# EasyEDA Pro project PCB_keyboard_V1_3_3.eprj

# Schematic PCB_keyboard
Board Name: PCB_keyboard; Create Date: 2025-07-01; Page Name: Sheet_1; Project Name: PCB_keyboard_V1_3_2; Schematic Name: PCB_keyboard; Update Date: 2025-07-01; Add into BOM: yes; Company: Your Company; Convert to PCB: yes; Date: 2025-05-16; REV: 1.0; Sheet: 1/1; spicePre: .
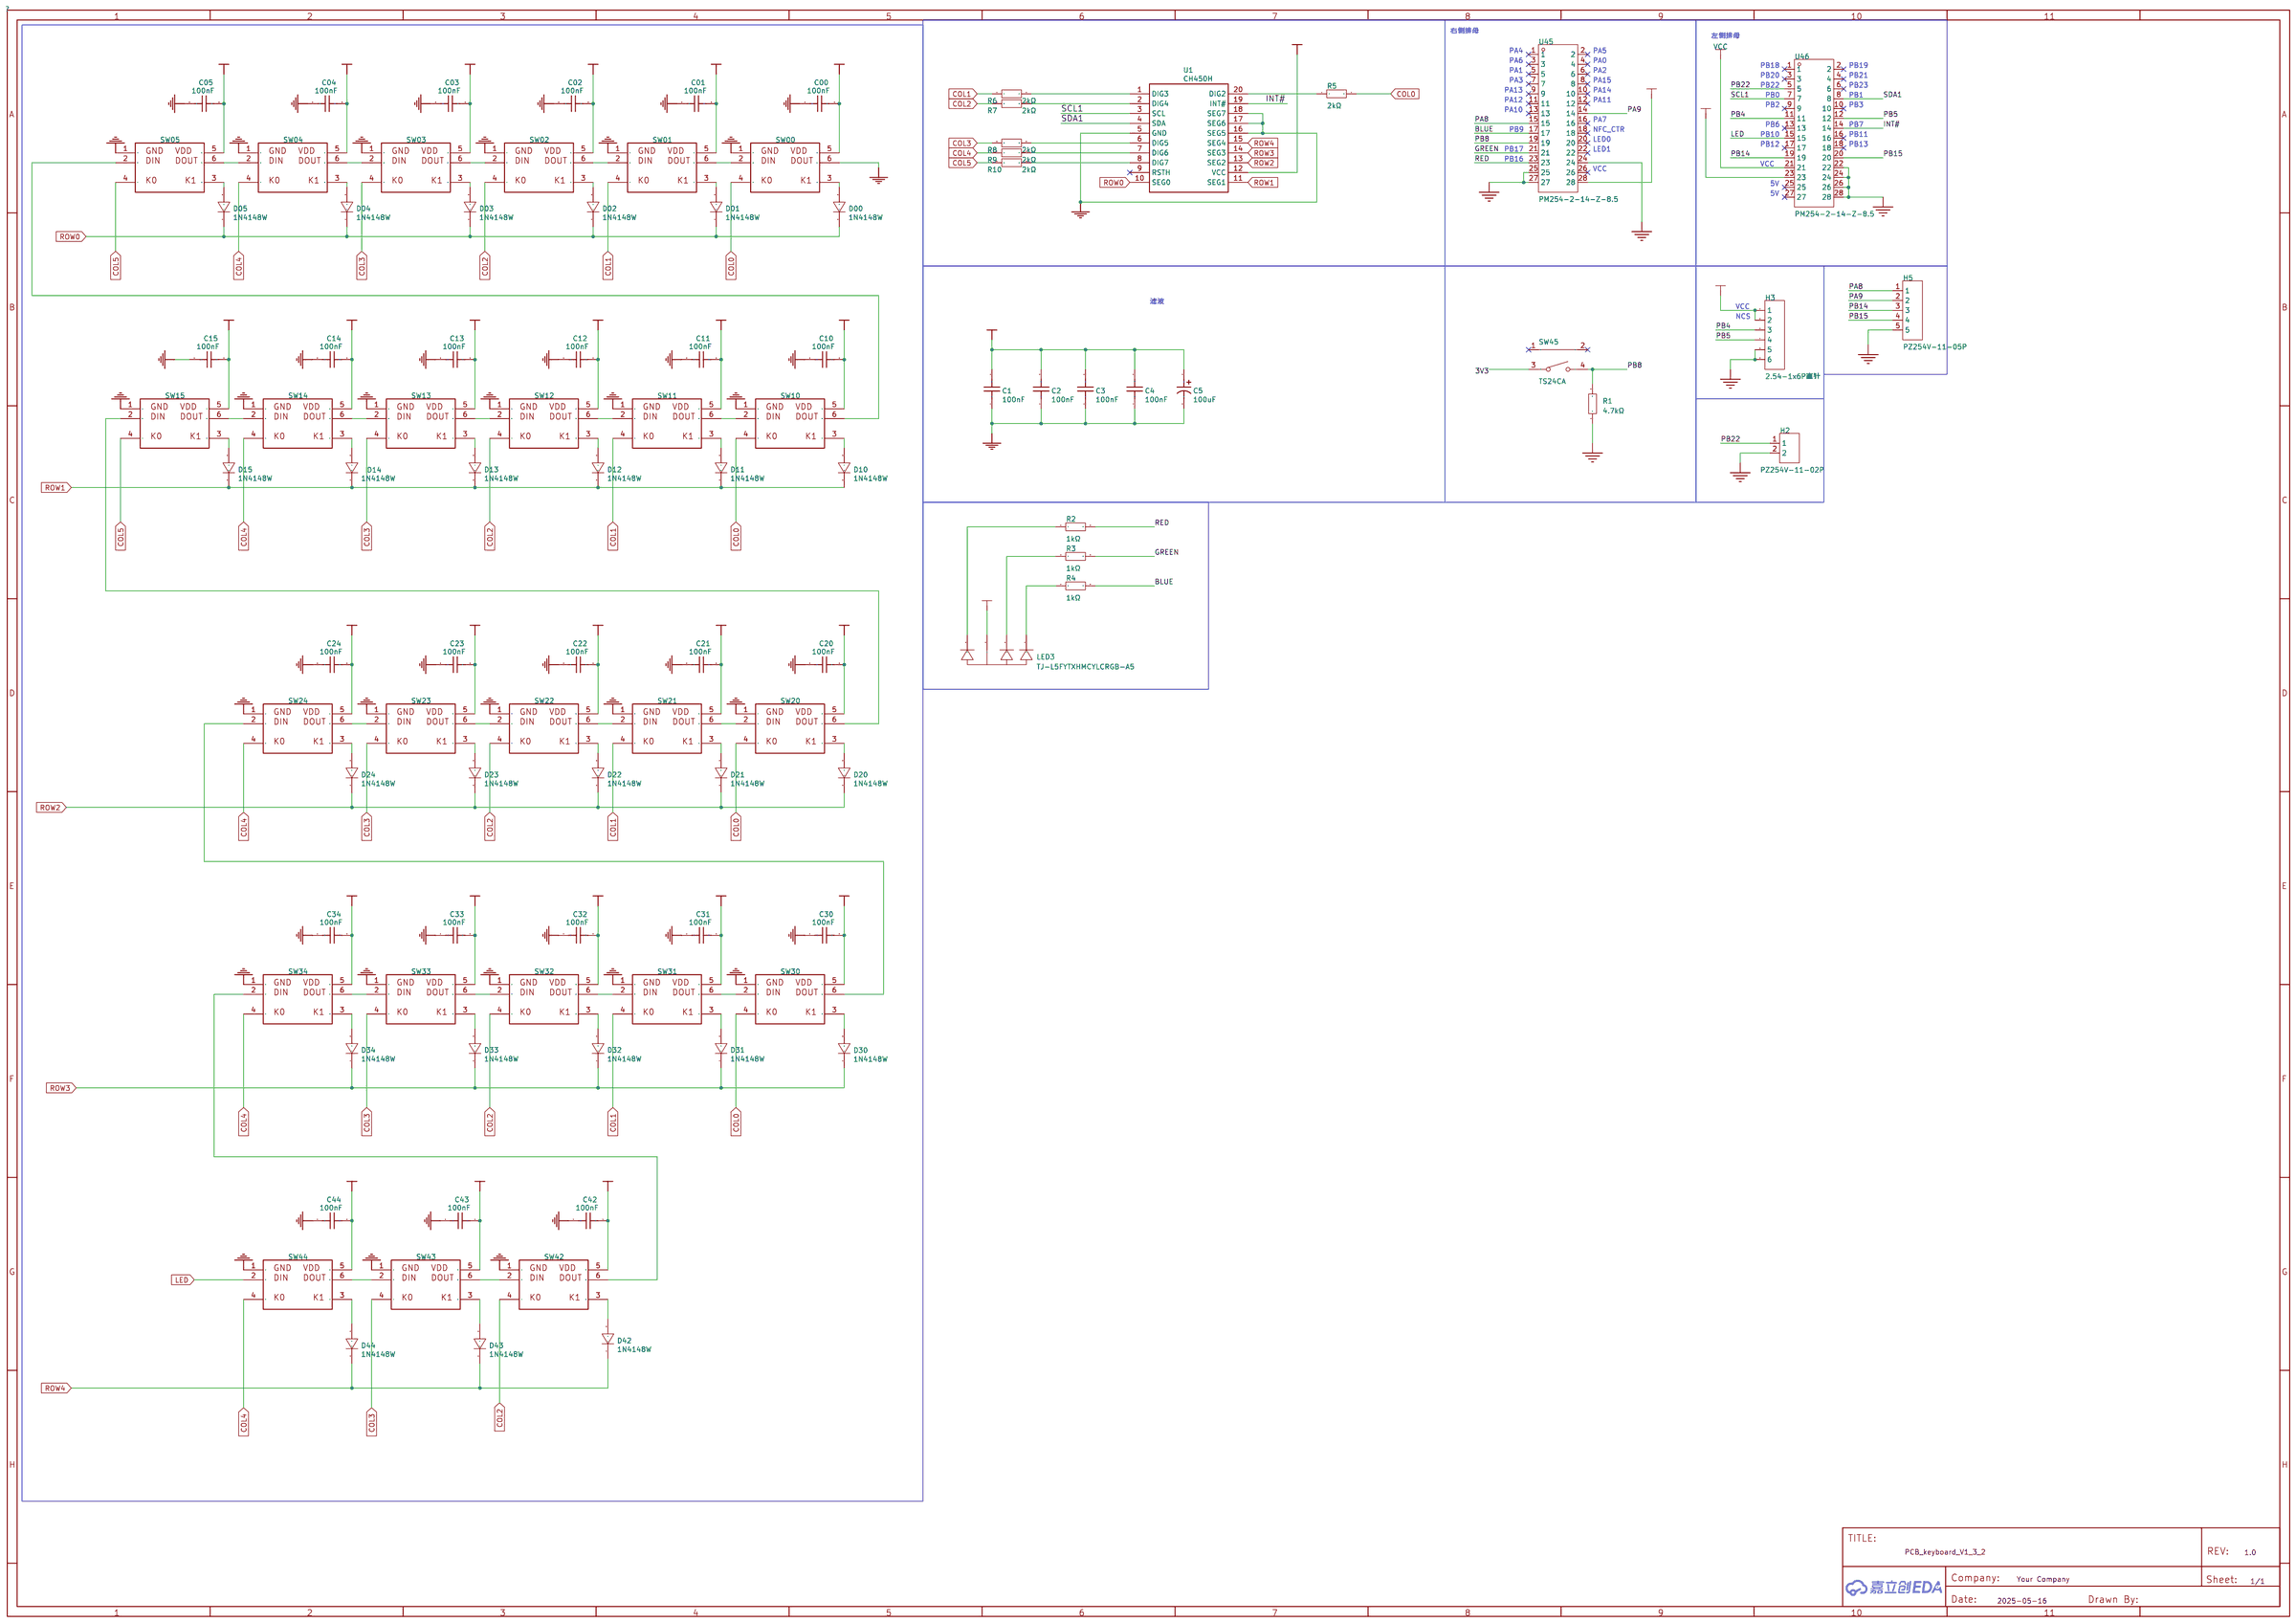
[diagram p0: schematic sheet]

## Parts
C00  100nF  [C0805]
C1  100nF  [C0805]
C01  100nF  [C0805]
C2  100nF  [C0805]
C02  100nF  [C0805]
C3  100nF  [C0805]
C03  100nF  [C0805]
C4  100nF  [C0805]
C04  100nF  [C0805]
C5  100uF  [CAP-TH_BD6.0-P2.50-D0.5-FD]
C05  100nF  [C0805]
C10  100nF  [C0805]
C11  100nF  [C0805]
C12  100nF  [C0805]
C13  100nF  [C0805]
C14  100nF  [C0805]
C15  100nF  [C0805]
C20  100nF  [C0805]
C21  100nF  [C0805]
C22  100nF  [C0805]
C23  100nF  [C0805]
C24  100nF  [C0805]
C30  100nF  [C0805]
C31  100nF  [C0805]
C32  100nF  [C0805]
C33  100nF  [C0805]
C34  100nF  [C0805]
C42  100nF  [C0805]
C43  100nF  [C0805]
C44  100nF  [C0805]
D00  1N4148W  [SOD-123_L2.8-W1.8-LS3.7-RD]
D01  1N4148W  [SOD-123_L2.8-W1.8-LS3.7-RD]
D02  1N4148W  [SOD-123_L2.8-W1.8-LS3.7-RD]
D03  1N4148W  [SOD-123_L2.8-W1.8-LS3.7-RD]
D04  1N4148W  [SOD-123_L2.8-W1.8-LS3.7-RD]
D05  1N4148W  [SOD-123_L2.8-W1.8-LS3.7-RD]
D10  1N4148W  [SOD-123_L2.8-W1.8-LS3.7-RD]
D11  1N4148W  [SOD-123_L2.8-W1.8-LS3.7-RD]
D12  1N4148W  [SOD-123_L2.8-W1.8-LS3.7-RD]
D13  1N4148W  [SOD-123_L2.8-W1.8-LS3.7-RD]
D14  1N4148W  [SOD-123_L2.8-W1.8-LS3.7-RD]
D15  1N4148W  [SOD-123_L2.8-W1.8-LS3.7-RD]
D20  1N4148W  [SOD-123_L2.8-W1.8-LS3.7-RD]
D21  1N4148W  [SOD-123_L2.8-W1.8-LS3.7-RD]
D22  1N4148W  [SOD-123_L2.8-W1.8-LS3.7-RD]
D23  1N4148W  [SOD-123_L2.8-W1.8-LS3.7-RD]
D24  1N4148W  [SOD-123_L2.8-W1.8-LS3.7-RD]
D30  1N4148W  [SOD-123_L2.8-W1.8-LS3.7-RD]
D31  1N4148W  [SOD-123_L2.8-W1.8-LS3.7-RD]
D32  1N4148W  [SOD-123_L2.8-W1.8-LS3.7-RD]
D33  1N4148W  [SOD-123_L2.8-W1.8-LS3.7-RD]
D34  1N4148W  [SOD-123_L2.8-W1.8-LS3.7-RD]
D42  1N4148W  [SOD-123_L2.8-W1.8-LS3.7-RD]
D43  1N4148W  [SOD-123_L2.8-W1.8-LS3.7-RD]
D44  1N4148W  [SOD-123_L2.8-W1.8-LS3.7-RD]
H2  PZ254V-11-02P  [HDR-TH_2P-P2.54-V-M]
H3  2.54-1x6P直针  [HDR-TH_6P-P2.54-V-M-1]
H5  PZ254V-11-05P  [HDR-TH_5P-P2.54-V-M]
LED3  TJ-L5FYTXHMCYLCRGB-A5  [LED-TH_4P-BD5.8-P1.30]
R1  4.7kΩ  [R0805]
R2  1kΩ  [R0805]
R3  1kΩ  [R0805]
R4  1kΩ  [R0805]
R5  2kΩ  [R0805]
R6  2kΩ  [R0805]
R7  2kΩ  [R0805]
R8  2kΩ  [R0805]
R9  2kΩ  [R0805]
R10  2kΩ  [R0805]
SW00  凯华轴座+3528反贴灯 COPY  [凯华轴座+3528反贴灯]
SW01  凯华轴座+3528反贴灯 COPY  [凯华轴座+3528反贴灯]
SW02  凯华轴座+3528反贴灯 COPY  [凯华轴座+3528反贴灯]
SW03  凯华轴座+3528反贴灯 COPY  [凯华轴座+3528反贴灯]
SW04  凯华轴座+3528反贴灯 COPY  [凯华轴座+3528反贴灯]
SW05  凯华轴座+3528反贴灯 COPY  [凯华轴座+3528反贴灯]
SW10  凯华轴座+3528反贴灯 COPY  [凯华轴座+3528反贴灯]
SW11  凯华轴座+3528反贴灯 COPY  [凯华轴座+3528反贴灯]
SW12  凯华轴座+3528反贴灯 COPY  [凯华轴座+3528反贴灯]
SW13  凯华轴座+3528反贴灯 COPY  [凯华轴座+3528反贴灯]
SW14  凯华轴座+3528反贴灯 COPY  [凯华轴座+3528反贴灯]
SW15  凯华轴座+3528反贴灯 COPY  [凯华轴座+3528反贴灯]
SW20  凯华轴座+3528反贴灯 COPY  [凯华轴座+3528反贴灯]
SW21  凯华轴座+3528反贴灯 COPY  [凯华轴座+3528反贴灯]
SW22  凯华轴座+3528反贴灯 COPY  [凯华轴座+3528反贴灯]
SW23  凯华轴座+3528反贴灯 COPY  [凯华轴座+3528反贴灯]
SW24  凯华轴座+3528反贴灯 COPY  [凯华轴座+3528反贴灯]
SW30  凯华轴座+3528反贴灯 COPY  [凯华轴座+3528反贴灯]
SW31  凯华轴座+3528反贴灯 COPY  [凯华轴座+3528反贴灯]
SW32  凯华轴座+3528反贴灯 COPY  [凯华轴座+3528反贴灯]
SW33  凯华轴座+3528反贴灯 COPY  [凯华轴座+3528反贴灯]
SW34  凯华轴座+3528反贴灯 COPY  [凯华轴座+3528反贴灯]
SW42  凯华轴座+3528反贴灯 COPY  [凯华轴座+3528反贴灯]
SW43  凯华轴座+3528反贴灯 COPY  [凯华轴座+3528反贴灯]
SW44  凯华轴座+3528反贴灯 COPY  [凯华轴座+3528反贴灯]
SW45  TS24CA  [SW-SMD_TS24CA]
U1  CH450H  [SOP-20_L12.7-W7.5-P1.27-LS10.3-BL]
U45  PM254-2-14-Z-8.5  [HDR-TH_28P-P2.54-V-F-R2-C14-S2.54-1]
U46  PM254-2-14-Z-8.5  [HDR-TH_28P-P2.54-V-F-R2-C14-S2.54-1]

## Library data of the parts
C00 C1 C01 C2 C02 C3 C03 C4 C04 C05 C10-C15 C20-C24 C30-C34 C42-C44 = FCC0805B104K500DT: 容值:100nF;精度:±10%;额定电压:50V;温度系数:X7R;; LCSC Part Name: 100nF ±10% 50V; Supplier Part: C5137467; Manufacturer: FOJAN(富捷); Supplier Footprint: 0805; JLCPCB Part Class: Extended Part; Datasheet: https://atta.szlcsc.com/upload/public/pdf/source/20220818/0EB3B7FB2F5648AC16609637FBA7DABE.pdf; Supplier: LCSC; Tolerance: ±10%; Voltage Rating: 50V; Temperature Coefficient: X7R
C5 = 100uF: Supplier: LCSC; Supplier Part: C2873969; Manufacturer: ROQANG(容强); Manufacturer Part: KM1E101M0611; link: https://so.szlcsc.com/global.html?k=C2873969&ref=editor; nameAlias: Value; Contributor: lcsc; spicePre: C; spiceSymbolName: KM1E101M0611
D00 D01 D02 D03 D04 D05 D10-D15 D20-D24 D30-D34 D42-D44 = 1N4148W_C2099: 二极管配置:独立式;正向压降(Vf):1.25V@150mA;直流反向耐压(Vr):100V;整流电流:150mA;反向恢复时间(trr):4ns;; LCSC Part Name: 丝印T4; Supplier Part: C2099; Manufacturer: CJ(江苏长电/长晶); Supplier Footprint: SOD-123; JLCPCB Part Class: Extended Part; Datasheet: https://atta.szlcsc.com/upload/public/pdf/source/20120428/1457706480199.pdf; Supplier: LCSC; Diode Configuration: 独立式; Forward Voltage (Vf@If): 1.25V@150mA; Reverse Voltage (Vr): 100V; Rectified Current: 150mA; Reverse Leakage Current: 1uA@75V; Reverse Recovery Time (trr): 4ns
H2 = PZ254V-11-02P: 插针结构:1x2P;间距:2.54mm;行距:-;圆针/方针:方针;安装方式:直插;排数:单排;总PIN位数:2P;额定电流:-;额定电压:-;配合针长度:6mm;塑高:2.5mm;端接针长度:3mm;触头材质:黄铜;触头镀层:-;工作温度:-40℃~+105℃;颜色:黑色;; LCSC Part Name: 1x2P 间距:2.54mm 方针 直插; Supplier Part: C492401; Manufacturer: XFCN(兴飞); Supplier Footprint: 插件,P=2.54mm; JLCPCB Part Class: 扩展库; Datasheet: https://atta.szlcsc.com/upload/public/pdf/source/20200309/C492401_A812433581A9B211A7FFA413ADDFF0E5.pdf; Supplier: LCSC; Pin Structure: 1x2P; Pitch: 2.54mm; Circluar Pins/Square Pins: 方针; Mounting Type: 直插; Number of Rows: 单排; Number of Pins: 2P; Length of Mating Pin: 6mm; Insulation Height: 2.5mm; Length of End Connection Pin: 3mm; Contact Material: 黄铜; Operating Temperature: -40℃~+105℃; Color: 黑色
H3 = 2.54-1x6P直针: 插针结构:1x6P;间距:2.54mm;行距:-;圆针/方针:方针;安装方式:直插;排数:单排;总PIN位数:6P;额定电流:3A;额定电压:-;配合针长度:-;塑高:-;触头材质:黄铜;触头镀层:-;工作温度:-40℃~+105℃;颜色:黑色;; LCSC Part Name: 1x6P 间距:2.54mm 方针 直插; Supplier Part: C37208; Manufacturer: BOOMELE(博穆精密); Supplier Footprint: 插件,P=2.54mm; JLCPCB Part Class: 扩展库; Datasheet: https://atta.szlcsc.com/upload/public/pdf/source/20250115/42A019761A40C8B839643401D8CA5A96.pdf; Supplier: LCSC; Pin Structure: 1x6P; Pitch: 2.54mm; Circluar Pins/Square Pins: 方针; Mounting Type: 直插; Number of Rows: 单排; Number of Pins: 6P; Current Rating: 3A; Contact Material: 黄铜; Operating Temperature: -40℃~+105℃; Color: 黑色
H5 = PZ254V-11-05P: 插针结构:1x5P;间距:2.54mm;行距:-;圆针/方针:方针;安装方式:直插;排数:单排;总PIN位数:5P;额定电流:-;额定电压:-;配合针长度:6mm;塑高:2.5mm;端接针长度:3mm;触头材质:黄铜;触头镀层:-;工作温度:-40℃~+105℃;颜色:黑色;; LCSC Part Name: 1x5P 间距:2.54mm 方针 直插; Supplier Part: C492404; Manufacturer: XFCN(兴飞); Supplier Footprint: 插件,P=2.54mm; JLCPCB Part Class: 扩展库; Datasheet: https://atta.szlcsc.com/upload/public/pdf/source/20200309/C492404_E51533260F8710EFF5D4617281164C1D.pdf; Supplier: LCSC; Pin Structure: 1x5P; Pitch: 2.54mm; Circluar Pins/Square Pins: 方针; Mounting Type: 直插; Number of Rows: 单排; Number of Pins: 5P; Length of Mating Pin: 6mm; Insulation Height: 2.5mm; Length of End Connection Pin: 3mm; Contact Material: 黄铜; Operating Temperature: -40℃~+105℃; Color: 黑色
LED3 = TJ-L5FYTXHMCYLCRGB-A5: 5MM圆头雾状共阳RGB,F5圆头三色共阳RGB; LCSC Part Name: RGB三色; Supplier Part: C331057; Manufacturer: TOGIALED(统佳); Supplier Footprint: 插件,D=5mm; JLCPCB Part Class: 扩展库; Datasheet: https://atta.szlcsc.com/upload/public/pdf/source/20181220/C331057_F3BDB7753810C2DAD015690180B7FC13.pdf; Supplier: LCSC
R1 = 0805W8F4701T5E: 电阻类型:厚膜电阻;阻值:4.7kΩ;精度:±1%;功率:125mW;最大工作电压:150V;温度系数:±100ppm/℃;; LCSC Part Name: 4.7kΩ ±1% 125mW 厚膜电阻; Supplier Part: C17673; Manufacturer: UNI-ROYAL(厚声); Supplier Footprint: 0805; JLCPCB Part Class: Basic Part; Datasheet: https://atta.szlcsc.com/upload/public/pdf/source/20200306/C422600_1E6D84923E4A46A82E41ADD87F860B5C.pdf; Supplier: LCSC; Type: 厚膜电阻; Tolerance: ±1%; Power(Watts): 125mW; Overload Voltage (Max): 150V; Temperature Coefficient: ±100ppm/℃; Operating Temperature Range: -55℃~+155℃
R2-R4 = 0805W8F1001T5E: 电阻类型:厚膜电阻;阻值:1kΩ;精度:±1%;功率:125mW;最大工作电压:150V;温度系数:±100ppm/℃;; LCSC Part Name: 1kΩ ±1% 125mW 厚膜电阻; Supplier Part: C17513; Manufacturer: UNI-ROYAL(厚声); Supplier Footprint: 0805; JLCPCB Part Class: Basic Part; Datasheet: https://atta.szlcsc.com/upload/public/pdf/source/20200306/C422600_1E6D84923E4A46A82E41ADD87F860B5C.pdf; Supplier: LCSC; Type: 厚膜电阻; Tolerance: ±1%; Power(Watts): 125mW; Overload Voltage (Max): 150V; Temperature Coefficient: ±100ppm/℃; Operating Temperature Range: -55℃~+155℃
R5-R10 = 0805W8F2001T5E: 电阻类型:厚膜电阻;阻值:2kΩ;精度:±1%;功率:125mW;最大工作电压:150V;温度系数:±100ppm/℃;; LCSC Part Name: 2kΩ ±1% 125mW 厚膜电阻; Supplier Part: C17604; Manufacturer: UNI-ROYAL(厚声); Supplier Footprint: 0805; JLCPCB Part Class: 基础库; Datasheet: https://atta.szlcsc.com/upload/public/pdf/source/20200306/C422600_1E6D84923E4A46A82E41ADD87F860B5C.pdf; Supplier: LCSC; Type: 厚膜电阻; Tolerance: ±1%; Power(Watts): 125mW; Overload Voltage (Max): 150V; Temperature Coefficient: ±100ppm/℃; Operating Temperature Range: -55℃~+155℃
SW00 SW01 SW02 SW03 SW04 SW05 SW10-SW15 SW20-SW24 SW30-SW34 SW42-SW44 = 凯华轴座+3528反贴灯 COPY
SW45 = TS24CA: 电路结构:单刀单掷;按钮形状:矩形按钮;安装方式:卧贴;开关长度:4.55mm;开关宽度:1.8mm;开关高度:3.5mm;触点电流:50mA;额定电压(DC):12V;带灯:-;机械寿命:-;; LCSC Part Name: 4.55*1.8*3.5mm 卧贴 轻触开关; Supplier Part: C393942; Manufacturer: SHOU HAN(首韩); Supplier Footprint: SMD; JLCPCB Part Class: 扩展库; Datasheet: https://atta.szlcsc.com/upload/public/pdf/source/20190521/C393942_591A9E318887EFA4274D34029981AD99.pdf; Supplier: LCSC; Circuit: 单刀单掷; Actuator Style: 矩形按钮; Mounting Style: 卧贴; Switch Length: 4.55mm; Switch Width: 1.8mm; Switch Height: 3.5mm; Contact Current: 50mA; Voltage Rating (DC): 12V
U1 = CH450H: Supplier: LCSC; Manufacturer: WCH(南京沁恒); Supplier Part: C56245; JLCPCB Part Class: Extended Part; spicePre: U
U45 U46 = PM254-2-14-Z-8.5: 插孔结构:2x14P;间距:2.54mm;行距:2.54mm;圆孔/方孔:方孔;安装类型:直插;排数:双排;总孔位数:28P;额定电流:3A;额定电压:-;插孔方向:顶部;塑高:8.5mm;触头材质:铜合金;工作温度范围:-40℃~+105℃;焊接温度(最大值):260℃@5S;; LCSC Part Name: 2x14P 间距:2.54mm 直插; Supplier Part: C2897415; Manufacturer: HCTL(华灿天禄); Supplier Footprint: 插件,P=2.54mm; JLCPCB Part Class: 扩展库; Datasheet: https://atta.szlcsc.com/upload/public/pdf/source/20230609/3D36CA2C1BFC9FD1C3F709AD9DFEB9C2.pdf; Supplier: LCSC; Holes Structure: 2x14P; Pitch: 2.54mm; Row Spacing: 2.54mm; Circular Hole / Square Hole: 方孔; Mounting Type: 直插; Number of Rows: 双排; Number of Holes: 28P; Current Rating (Max): 3A; Holes Direction: 顶部; Insulation Height: 8.5mm; Contact Material: 铜合金; Operating Temperature Range: -40℃~+105℃; Soldering Temperature(Max): 260℃@5S

## Nets
3V3: H3.1 H3.2 LED3.2(+) SW45.3 U45.28 U46.23
GND: C00.1 C1.1 C01.1 C2.1 C02.1 C3.1 C03.1 C4.1 C04.1 C05.1 C5.2 C10.1 C11.1 C12.1 C13.1 C14.1 C15.1 C20.1 C21.1 C22.1 C23.1 C24.1 C30.1 C31.1 C32.1 C33.1 C34.1 C42.1 C43.1 C44.1 H2.2 H3.5 H3.6 H5.5 R1.1 SW00.1 SW00.6 SW01.1 SW02.1 SW03.1 SW04.1 SW05.1 SW10.1 SW11.1 SW12.1 SW13.1 SW14.1 SW15.1 SW20.1 SW21.1 SW22.1 SW23.1 SW24.1 SW30.1 SW31.1 SW32.1 SW33.1 SW34.1 SW42.1 SW43.1 SW44.1 U1.5(GND) U1.16(SEG5) U1.17(SEG6) U1.18(SEG7) U45.24 U45.25 U45.27 U46.22 U46.24 U46.26 U46.28
VCC: C00.2 C1.2 C01.2 C2.2 C02.2 C3.2 C03.2 C4.2 C04.2 C5.1 C05.2 C10.2 C11.2 C12.2 C13.2 C14.2 C15.2 C20.2 C21.2 C22.2 C23.2 C24.2 C30.2 C31.2 C32.2 C33.2 C34.2 C42.2 C43.2 C44.2 SW00.5 SW01.5 SW02.5 SW03.5 SW04.5 SW05.5 SW10.5 SW11.5 SW12.5 SW13.5 SW14.5 SW15.5 SW20.5 SW21.5 SW22.5 SW23.5 SW24.5 SW30.5 SW31.5 SW32.5 SW33.5 SW34.5 SW42.5 SW43.5 SW44.5 U1.12(VCC) U46.21
BLUE: R4.2 U45.17
COL0: R5.2 SW00.4 SW10.4 SW20.4 SW30.4
COL1: R6.1 SW01.4 SW11.4 SW21.4 SW31.4
COL2: R7.1 SW02.4 SW12.4 SW22.4 SW32.4 SW42.4
COL3: R8.1 SW03.4 SW13.4 SW23.4 SW33.4 SW43.4
COL4: R9.1 SW04.4 SW14.4 SW24.4 SW34.4 SW44.4
COL5: R10.1 SW05.4 SW15.4
GREEN: R3.2 U45.21
INT#: U1.19(INT#) U46.14
LED: SW44.2 U46.15
PA8: H5.1 U45.15
PA9: H5.2 U45.14
PB4: H3.3 U46.11
PB5: H3.4 U46.12
PB8: R1.2 SW45.4 U45.19
PB14: H5.3 U46.19
PB15: H5.4 U46.20
PB22: H2.1 U46.5
RED: R2.2 U45.23
ROW0: D00.1(K) D01.1(K) D02.1(K) D03.1(K) D04.1(K) D05.1(K) U1.10(SEG0)
ROW1: D10.1(K) D11.1(K) D12.1(K) D13.1(K) D14.1(K) D15.1(K) U1.11(SEG1)
ROW2: D20.1(K) D21.1(K) D22.1(K) D23.1(K) D24.1(K) U1.13(SEG2)
ROW3: D30.1(K) D31.1(K) D32.1(K) D33.1(K) D34.1(K) U1.14(SEG3)
ROW4: D42.1(K) D43.1(K) D44.1(K) U1.15(SEG4)
SCL1: U1.3(SCL) U46.7
SDA1: U1.4(SDA) U46.8
$1N69: D00.2(A) SW00.3
$1N70: D01.2(A) SW01.3
$1N71: D02.2(A) SW02.3
$1N72: D03.2(A) SW03.3
$1N73: D04.2(A) SW04.3
$1N74: D05.2(A) SW05.3
$1N77: D10.2(A) SW10.3
$1N78: D11.2(A) SW11.3
$1N79: D12.2(A) SW12.3
$1N80: D13.2(A) SW13.3
$1N81: D14.2(A) SW14.3
$1N82: D15.2(A) SW15.3
$1N83: D20.2(A) SW20.3
$1N84: D21.2(A) SW21.3
$1N85: D22.2(A) SW22.3
$1N86: D23.2(A) SW23.3
$1N87: D24.2(A) SW24.3
$1N90: D30.2(A) SW30.3
$1N91: D31.2(A) SW31.3
$1N92: D32.2(A) SW32.3
$1N95: D33.2(A) SW33.3
$1N97: D34.2(A) SW34.3
$1N99: D42.2(A) SW42.3
$1N100: D43.2(A) SW43.3
$1N101: D44.2(A) SW44.3
$1N102: SW42.2 SW43.6
$1N103: SW43.2 SW44.6
$1N108: SW34.2 SW42.6
$1N109: SW33.2 SW34.6
$1N110: SW32.2 SW33.6
$1N111: SW31.2 SW32.6
$1N112: SW30.2 SW31.6
$1N113: SW24.2 SW30.6
$1N114: SW23.2 SW24.6
$1N115: SW22.2 SW23.6
$1N116: SW21.2 SW22.6
$1N117: SW20.2 SW21.6
$1N118: SW15.2 SW20.6
$1N119: SW14.2 SW15.6
$1N120: SW13.2 SW14.6
$1N121: SW12.2 SW13.6
$1N122: SW11.2 SW12.6
$1N123: SW10.2 SW11.6
$1N125: SW04.2 SW05.6
$1N126: SW03.2 SW04.6
$1N127: SW02.2 SW03.6
$1N128: SW01.2 SW02.6
$1N129: SW00.2 SW01.6
$1N130: SW05.2 SW10.6
$1N63158: LED3.1 R2.1
$1N63164: LED3.3 R3.1
$1N63171: LED3.4 R4.1
$1N70752: R5.1 U1.20(DIG2)
$1N70795: R6.2 U1.1(DIG3)
$1N70838: R7.2 U1.2(DIG4)
$1N70881: R8.2 U1.6(DIG5)
$1N70924: R9.2 U1.7(DIG6)
$1N70967: R10.2 U1.8(DIG7)

Not connected (* = marked no-connect by the designer): SW45 1* 2*; U1 9(RSTH)*; U45 1* 2* 3* 4* 5* 6* 7* 8* 9* 10* 11* 12* 13* 16* 18* 20* 22* 26*; U46 1* 2* 3* 4* 6* 9* 10* 13* 16* 17* 18* 25* 27*

## Notes on the sheet
- 右侧排母
- 左侧排母
- PA4
- PA5
- PA6
- PA0
- PB18
- PB19
- PA1
- PA3
- PA15
- PA2
- PB20
- PB21
- PA13
- PA14
- PB22
- PB23
- PA12
- PA11
- PB0
- PB2
- PB1
- PB3
- PA10
- PA7
- PB6
- PB7
- PB9
- LED0
- NFC_CTR
- PB10
- PB11
- PB17
- LED1
- PB12
- PB13
- PB16
- VCC
- VCC
- 5V
- 5V
- 滤波
- VCC
- NCS

# Board PCB_PCB_keyboard
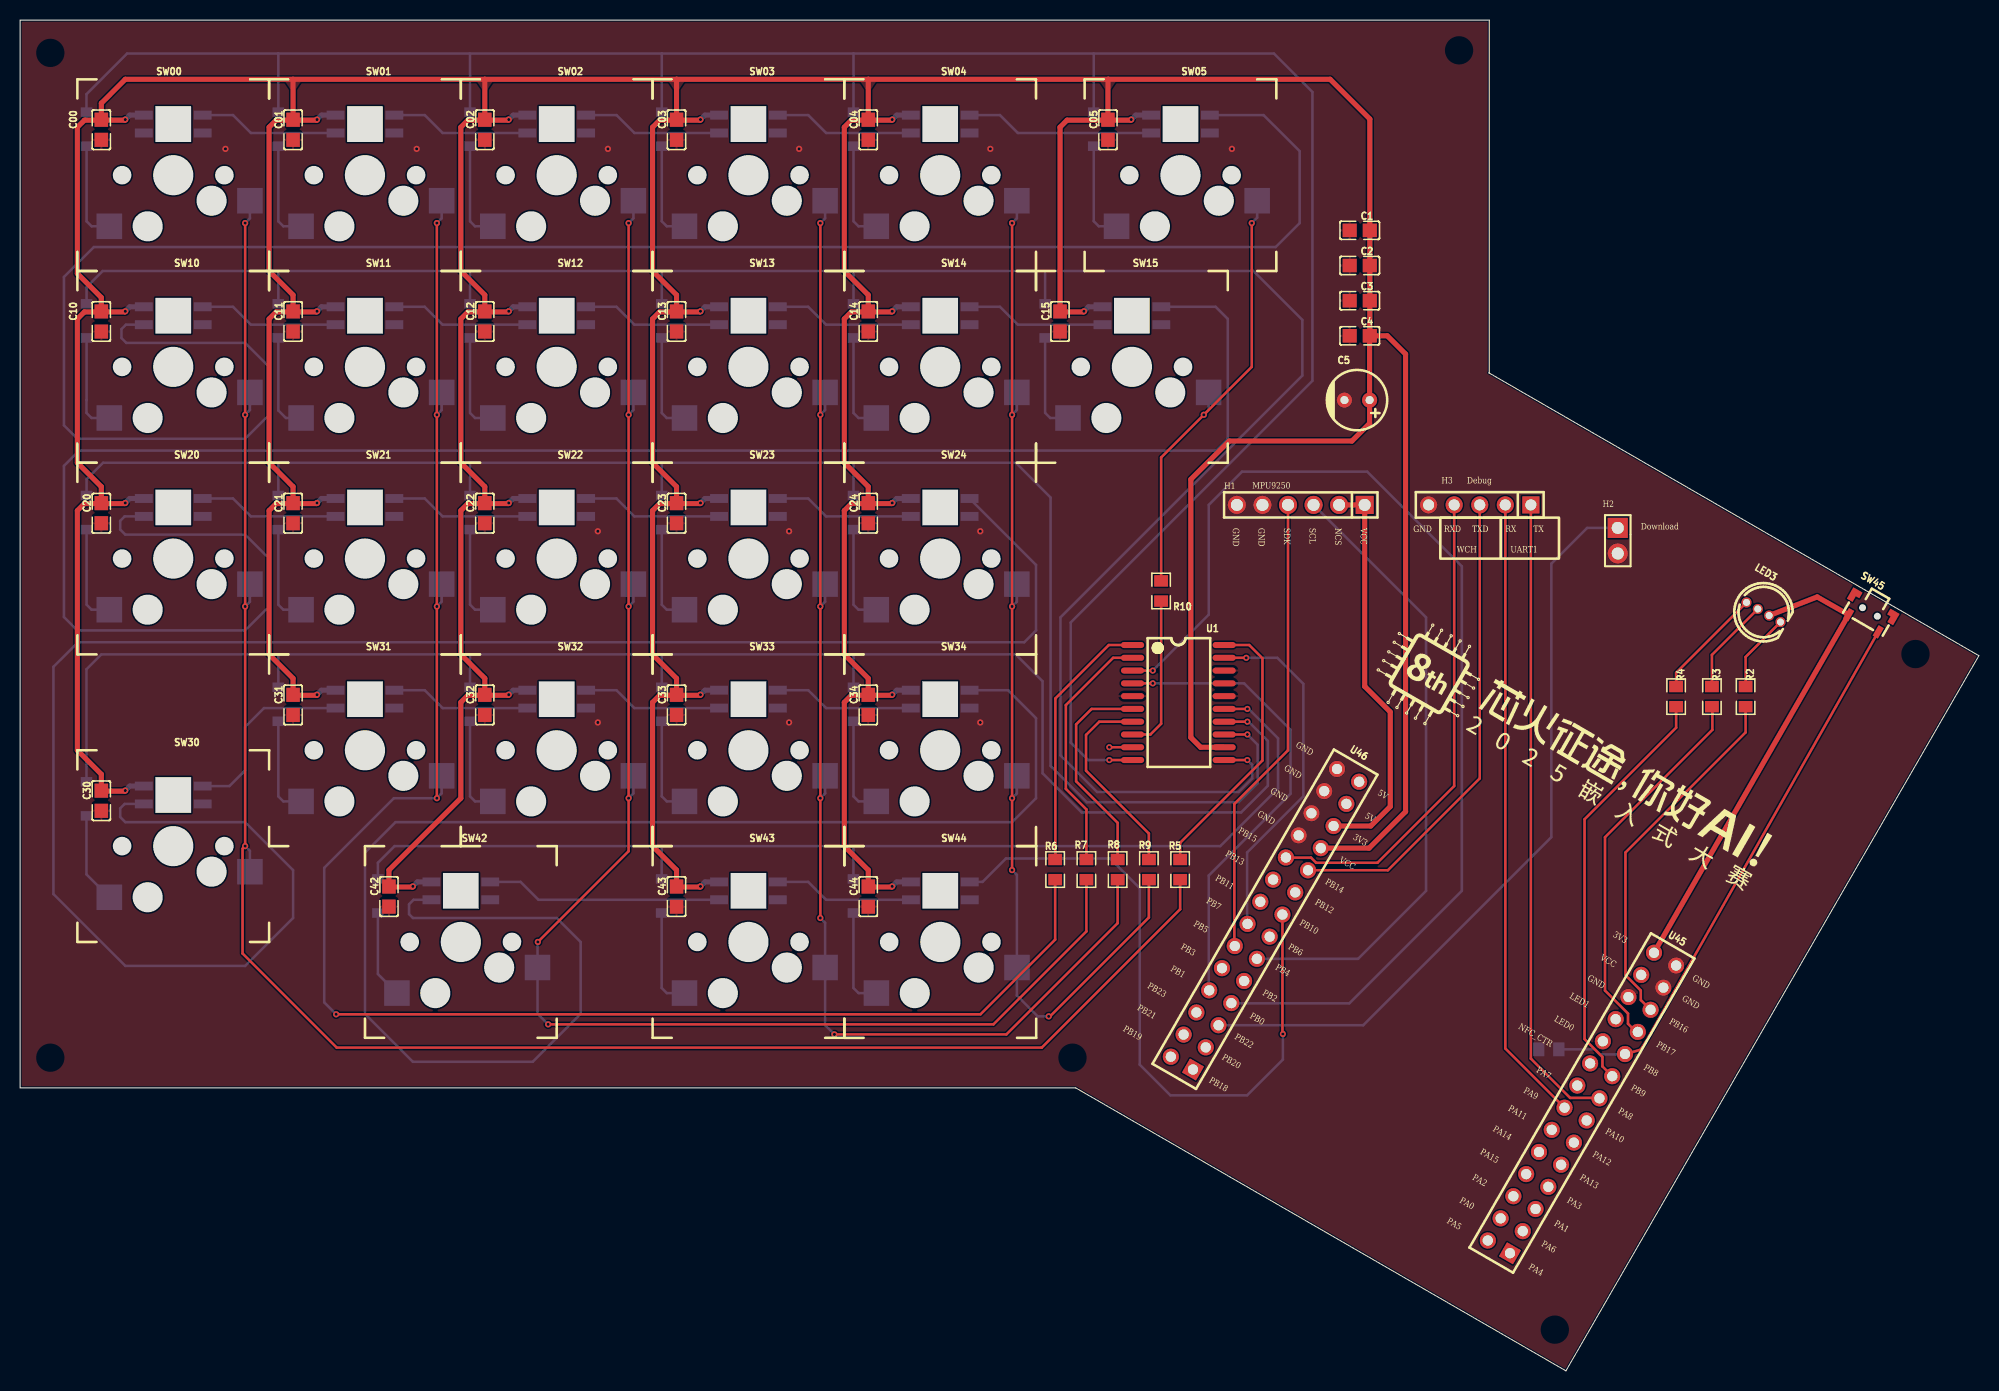
[diagram p1: board, top side]
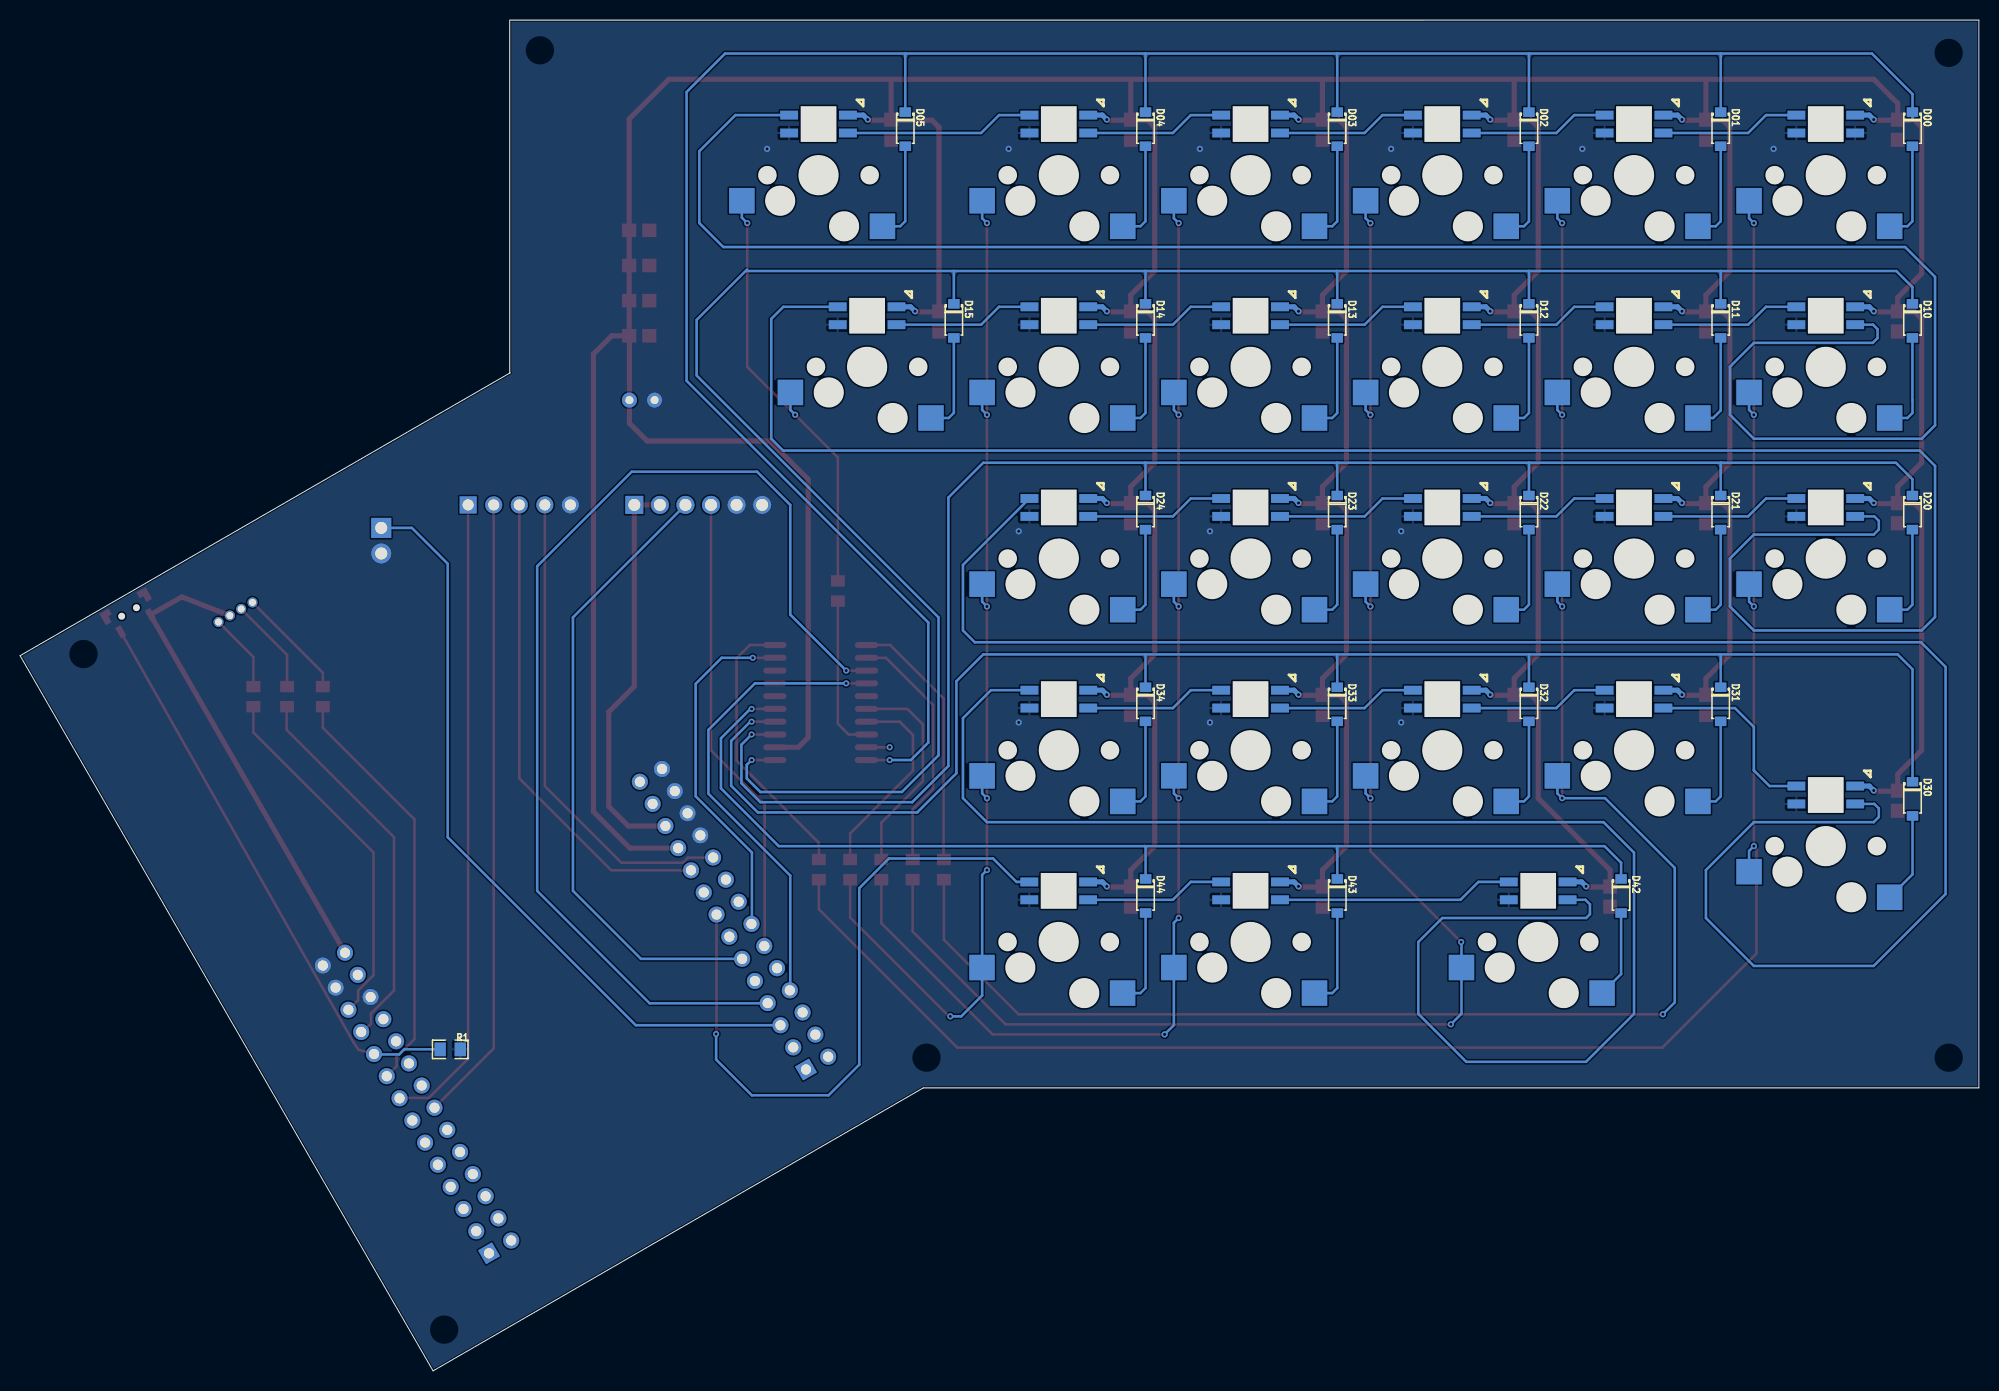
[diagram p2: board, bottom side, seen from below]

Outline 194.62 x 134.23 mm; copper layers: Top Layer, Bottom Layer. Coordinates in mm from the lower left corner of the outline.
Outline path: 145.97,99.15 145.9,99.19 ; 145.97,99.15 145.97,134.23 0,134.23 0,28.12 104.87,28.12 153.58,0 194.62,71.07 145.97,99.15
Stack: Top Layer 0.035mm / Dielectric1 1.51mm FR4 er 4.5 / Bottom Layer 0.035mm

## Design rules (mm)
spacing Default (default): track to track 0.152, other pairs 0 to 0.152
track width Default (default): min 0.254, default 0.254, max 25.4
differential pair differentialPair (default): width min 0.127, default 0.254, max 2.54; gap min 0.152, default 0.152
via Default (default): diameter min 0.61, default 0.61, max 100.025; hole min 0.305, default 0.305, max 59.995

## Placement (name value [footprint] x y rotation side)
C00  100nF  [C0805]  8.07 123.33 90 top
C01  100nF  [C0805]  27.12 123.33 90 top
C1  100nF  [C0805]  133.1 113.34 0 top
C02  100nF  [C0805]  46.17 123.33 90 top
C2  100nF  [C0805]  133.1 109.84 0 top
C03  100nF  [C0805]  65.22 123.33 90 top
C3  100nF  [C0805]  133.1 106.35 0 top
C04  100nF  [C0805]  84.27 123.33 90 top
C4  100nF  [C0805]  133.1 102.86 0 top
C05  100nF  [C0805]  108.08 123.33 90 top
C5  100uF  [CAP-TH_BD6.0-P2.50-D0.5-FD]  132.83 96.47 180 top
C10  100nF  [C0805]  8.07 104.28 90 top
C11  100nF  [C0805]  27.12 104.28 90 top
C12  100nF  [C0805]  46.17 104.28 90 top
C13  100nF  [C0805]  65.22 104.28 90 top
C14  100nF  [C0805]  84.27 104.28 90 top
C15  100nF  [C0805]  103.32 104.28 90 top
C20  100nF  [C0805]  8.07 85.23 90 top
C21  100nF  [C0805]  27.12 85.23 90 top
C22  100nF  [C0805]  46.17 85.23 90 top
C23  100nF  [C0805]  65.22 85.23 90 top
C24  100nF  [C0805]  84.27 85.23 90 top
C30  100nF  [C0805]  8.07 56.66 90 top
C31  100nF  [C0805]  27.12 66.18 90 top
C32  100nF  [C0805]  46.17 66.18 90 top
C33  100nF  [C0805]  65.22 66.18 90 top
C34  100nF  [C0805]  84.27 66.18 90 top
C42  100nF  [C0805]  36.64 47.13 90 top
C43  100nF  [C0805]  65.22 47.13 90 top
C44  100nF  [C0805]  84.27 47.13 90 top
D00  1N4148W  [SOD-123_L2.8-W1.8-LS3.7-RD]  6.6 123.39 270 bottom
D01  1N4148W  [SOD-123_L2.8-W1.8-LS3.7-RD]  25.65 123.39 270 bottom
D02  1N4148W  [SOD-123_L2.8-W1.8-LS3.7-RD]  44.7 123.39 270 bottom
D03  1N4148W  [SOD-123_L2.8-W1.8-LS3.7-RD]  63.75 123.39 270 bottom
D04  1N4148W  [SOD-123_L2.8-W1.8-LS3.7-RD]  82.8 123.39 270 bottom
D05  1N4148W  [SOD-123_L2.8-W1.8-LS3.7-RD]  106.67 123.39 270 bottom
D10  1N4148W  [SOD-123_L2.8-W1.8-LS3.7-RD]  6.6 104.34 270 bottom
D11  1N4148W  [SOD-123_L2.8-W1.8-LS3.7-RD]  25.65 104.34 270 bottom
D12  1N4148W  [SOD-123_L2.8-W1.8-LS3.7-RD]  44.7 104.34 270 bottom
D13  1N4148W  [SOD-123_L2.8-W1.8-LS3.7-RD]  63.75 104.34 270 bottom
D14  1N4148W  [SOD-123_L2.8-W1.8-LS3.7-RD]  82.8 104.34 270 bottom
D15  1N4148W  [SOD-123_L2.8-W1.8-LS3.7-RD]  101.84 104.34 270 bottom
D20  1N4148W  [SOD-123_L2.8-W1.8-LS3.7-RD]  6.6 85.29 270 bottom
D21  1N4148W  [SOD-123_L2.8-W1.8-LS3.7-RD]  25.65 85.29 270 bottom
D22  1N4148W  [SOD-123_L2.8-W1.8-LS3.7-RD]  44.7 85.29 270 bottom
D23  1N4148W  [SOD-123_L2.8-W1.8-LS3.7-RD]  63.75 85.29 270 bottom
D24  1N4148W  [SOD-123_L2.8-W1.8-LS3.7-RD]  82.8 85.29 270 bottom
D30  1N4148W  [SOD-123_L2.8-W1.8-LS3.7-RD]  6.59 56.84 270 bottom
D31  1N4148W  [SOD-123_L2.8-W1.8-LS3.7-RD]  25.65 66.24 270 bottom
D32  1N4148W  [SOD-123_L2.8-W1.8-LS3.7-RD]  44.7 66.24 270 bottom
D33  1N4148W  [SOD-123_L2.8-W1.8-LS3.7-RD]  63.75 66.24 270 bottom
D34  1N4148W  [SOD-123_L2.8-W1.8-LS3.7-RD]  82.8 66.24 270 bottom
D42  1N4148W  [SOD-123_L2.8-W1.8-LS3.7-RD]  35.55 47.19 270 bottom
D43  1N4148W  [SOD-123_L2.8-W1.8-LS3.7-RD]  63.74 47.19 270 bottom
D44  1N4148W  [SOD-123_L2.8-W1.8-LS3.7-RD]  82.79 47.19 270 bottom
H2  PZ254V-11-02P  [HDR-TH_2P-P2.54-V-M]  158.74 82.5 270 top
H3  2.54-1x6P直针  [HDR-TH_6P-P2.54-V-M-1]  127.24 86.05 180 top
H5  PZ254V-11-05P  [HDR-TH_5P-P2.54-V-M]  145.02 86.05 180 top
LED3  TJ-L5FYTXHMCYLCRGB-A5  [LED-TH_4P-BD5.8-P1.30]  173.22 75.39 330 top
R1  4.7kΩ  [R0805]  151.88 31.95 0 bottom
R2  1kΩ  [R0805]  171.44 67 270 top
R3  1kΩ  [R0805]  168.09 67 270 top
R4  1kΩ  [R0805]  164.53 67 270 top
R5  2kΩ  [R0805]  115.25 49.82 270 top
R6  2kΩ  [R0805]  102.84 49.82 90 top
R7  2kΩ  [R0805]  105.94 49.82 90 top
R8  2kΩ  [R0805]  109.05 49.82 90 top
R9  2kΩ  [R0805]  112.15 49.82 90 top
R10  2kΩ  [R0805]  113.37 77.5 270 top
SW00  凯华轴座+3528反贴灯 COPY  [凯华轴座+3528反贴灯]  15.21 118.82 0 top
SW01  凯华轴座+3528反贴灯 COPY  [凯华轴座+3528反贴灯]  34.26 118.82 0 top
SW02  凯华轴座+3528反贴灯 COPY  [凯华轴座+3528反贴灯]  53.31 118.82 0 top
SW03  凯华轴座+3528反贴灯 COPY  [凯华轴座+3528反贴灯]  72.36 118.82 0 top
SW04  凯华轴座+3528反贴灯 COPY  [凯华轴座+3528反贴灯]  91.41 118.82 0 top
SW05  凯华轴座+3528反贴灯 COPY  [凯华轴座+3528反贴灯]  115.29 118.82 0 top
SW10  凯华轴座+3528反贴灯 COPY  [凯华轴座+3528反贴灯]  15.21 99.77 0 top
SW11  凯华轴座+3528反贴灯 COPY  [凯华轴座+3528反贴灯]  34.26 99.77 0 top
SW12  凯华轴座+3528反贴灯 COPY  [凯华轴座+3528反贴灯]  53.31 99.77 0 top
SW13  凯华轴座+3528反贴灯 COPY  [凯华轴座+3528反贴灯]  72.36 99.77 0 top
SW14  凯华轴座+3528反贴灯 COPY  [凯华轴座+3528反贴灯]  91.41 99.77 0 top
SW15  凯华轴座+3528反贴灯 COPY  [凯华轴座+3528反贴灯]  110.46 99.77 0 top
SW20  凯华轴座+3528反贴灯 COPY  [凯华轴座+3528反贴灯]  15.21 80.72 0 top
SW21  凯华轴座+3528反贴灯 COPY  [凯华轴座+3528反贴灯]  34.26 80.72 0 top
SW22  凯华轴座+3528反贴灯 COPY  [凯华轴座+3528反贴灯]  53.31 80.72 0 top
SW23  凯华轴座+3528反贴灯 COPY  [凯华轴座+3528反贴灯]  72.36 80.72 0 top
SW24  凯华轴座+3528反贴灯 COPY  [凯华轴座+3528反贴灯]  91.41 80.72 0 top
SW30  凯华轴座+3528反贴灯 COPY  [凯华轴座+3528反贴灯]  15.21 52.15 0 top
SW31  凯华轴座+3528反贴灯 COPY  [凯华轴座+3528反贴灯]  34.26 61.67 0 top
SW32  凯华轴座+3528反贴灯 COPY  [凯华轴座+3528反贴灯]  53.31 61.67 0 top
SW33  凯华轴座+3528反贴灯 COPY  [凯华轴座+3528反贴灯]  72.36 61.67 0 top
SW34  凯华轴座+3528反贴灯 COPY  [凯华轴座+3528反贴灯]  91.41 61.67 0 top
SW42  凯华轴座+3528反贴灯 COPY  [凯华轴座+3528反贴灯]  43.79 42.62 0 top
SW43  凯华轴座+3528反贴灯 COPY  [凯华轴座+3528反贴灯]  72.36 42.62 0 top
SW44  凯华轴座+3528反贴灯 COPY  [凯华轴座+3528反贴灯]  91.43 42.62 0 top
SW45  TS24CA  [SW-SMD_TS24CA]  183.63 75.13 330 top
U1  CH450H  [SOP-20_L12.7-W7.5-P1.27-LS10.3-BL]  115.08 66.42 270 top
U45  PM254-2-14-Z-8.5  [HDR-TH_28P-P2.54-V-F-R2-C14-S2.54-1]  155.18 26.62 60 top
U46  PM254-2-14-Z-8.5  [HDR-TH_28P-P2.54-V-F-R2-C14-S2.54-1]  123.69 44.88 60 top

## Footprints (pads in the part's own frame, mm; a bottom-side part is the same pattern mirrored in y, then rotated)
C0805
  rect 1.41x1.35 smd: 1(-1,0) 2(1,0)
CAP-TH_BD6.0-P2.50-D0.5-FD
  round 1.5 hole 0.8: 1(-1.25,0) 2(1.25,0)
HDR-TH_2P-P2.54-V-M
  rect 2x2 hole 1.2: 1(-1.27,0)
  round 2 hole 1.2: 2(1.27,0)
HDR-TH_5P-P2.54-V-M
  rect 1.7x1.7 hole 1.1: 1(-5.08,0)
  round 1.7 hole 1.1: 2(-2.54,0) 3(0,0) 4(2.54,0) 5(5.08,0)
HDR-TH_6P-P2.54-V-M-1
  rect 1.8x1.8 hole 1.2: 1(-6.35,0)
  round 1.8 hole 1.2: 2(-3.81,0) 3(-1.27,0) 4(1.27,0) 5(3.81,0) 6(6.35,0)
HDR-TH_28P-P2.54-V-F-R2-C14-S2.54-1
  rect 1.6x1.6 hole 1.02: 1(-16.51,-1.27)
  round 1.6 hole 1.02: 2(-16.51,1.27) 3(-13.97,-1.27) 4(-13.97,1.27) 5(-11.43,-1.27) 6(-11.43,1.27) 7(-8.89,-1.27) 8(-8.89,1.27) 9(-6.35,-1.27) 10(-6.35,1.27) 11(-3.81,-1.27) 12(-3.81,1.27) 13(-1.27,-1.27) 14(-1.27,1.27) 15(1.27,-1.27) 16(1.27,1.27) 17(3.81,-1.27) 18(3.81,1.27) 19(6.35,-1.27) 20(6.35,1.27) 21(8.89,-1.27) 22(8.89,1.27) 23(11.43,-1.27) 24(11.43,1.27) 25(13.97,-1.27) 26(13.97,1.27) 27(16.51,-1.27) 28(16.51,1.27)
LED-TH_4P-BD5.8-P1.30
  round 1 hole 0.7: 1(1.95,0) 2(0.65,0) 3(-0.65,0) 4(-1.95,0)
R0805
  rect 1.133x1.377 smd: 1(-1,0) 2(1,0)
SOD-123_L2.8-W1.8-LS3.7-RD
  rect 0.95x1.15 smd: 1(-1.692,0) 2(1.692,0)
SOP-20_L12.7-W7.5-P1.27-LS10.3-BL
  oval 0.6x2.3 smd: 1(-5.715,-4.55) 2(-4.445,-4.55) 3(-3.175,-4.55) 4(-1.905,-4.55) 5(-0.635,-4.55) 6(0.635,-4.55) 7(1.905,-4.55) 8(3.175,-4.55) 9(4.445,-4.55) 10(5.715,-4.55) 11(5.715,4.55) 12(4.445,4.55) 13(3.175,4.55) 14(1.905,4.55) 15(0.635,4.55) 16(-0.635,4.55) 17(-1.905,4.55) 18(-3.175,4.55) 19(-4.445,4.55) 20(-5.715,4.55)
SW-SMD_TS24CA
  custom 1.05x1.3 smd: 1(-2.125,0.975) 2(2.125,0.975)
  rect 0.6x1.2 smd: 3(-1.7,-0.975) 4(1.7,-0.975)
凯华轴座+3528反贴灯
  rect 1.778x0.889 smd far side: 1(2.921,4.191) 2(2.921,5.969) 5(-2.921,5.969) 6(-2.921,4.191)
  rect 2.54x2.54 smd far side: 3(-6.35,-5.08) 4(7.62,-2.54)

## Nets
As in the schematic, except:
3V3$1: H3.1 H3.2 U46.23
3V3$2: LED3.2 SW45.3 U45.28

Pads without a net: SW45 1 2; U45 1 2 3 4 5 6 7 8 9 10 11 12 13 16 18 20 22 26; U46 1 2 3 4 6 9 10 13 16 17 18 25 27

## Via types
v1: diameter 0.62, hole 0.31, Top Layer to Bottom Layer, 66 vias
v2: diameter 0.61, hole 0.305, Top Layer to Bottom Layer, 10 vias

## Routing (per net, layer and track width the routed paths; a pad name or vN(x,y) marks a point on that pad's centre or on a via; arc(x,y) is an arc through that point)
3V3$1: length 40
  Top Layer w0.508: 130.5,54.14 134.19,54.14 136.13,56.08 136.13,65.48 133.59,68.02 H3.1 H3.2
3V3$2: length 47.5
  Top Layer w0.508: 162.34,41.55 SW45.3 178.55,76.91 173.78,75.06
GND:
  vias: v1(20.4,121.43) v1(39.4,121.43) v1(57.4,83.43) v1(57.4,64.43) v1(58.4,121.43) v1(76.4,83.43) v1(76.4,64.43) v1(77.4,121.43) v1(95.4,83.43) v1(95.4,64.43) v1(96.4,121.43) v1(120.4,121.43)
VCC: length 831.9
  Top Layer w0.508: v1(105.7,105.3) 105.64,105.24 103.32,105.24 103.32,123.59 104.02,124.29 108.08,124.29 ; v1(86.65,86.25) 86.59,86.19 84.27,86.19 ; 65.22,67.13 63.54,67.13 62.84,66.43 62.84,52.15 65.22,49.77 65.22,48.08 67.54,48.08 v1(67.6,48.15) ; 65.22,67.13 65.22,68.82 62.84,71.2 62.84,85.49 63.54,86.19 65.22,86.19 ; 65.22,67.13 67.54,67.13 v1(67.6,67.2) ; 119.63,61.97 117.29,61.97 116.32,62.94 116.32,88.59 120.13,92.4 132.32,92.4 134.08,94.16 C5.1 134.08,102.83 ; v1(67.6,86.25) 67.54,86.19 65.22,86.19 ; 8.07,105.24 6.39,105.24 5.69,104.53 5.69,90.25 8.07,87.87 8.07,86.19 ; 8.07,105.24 10.39,105.24 v1(10.45,105.3) ; 8.07,105.24 8.07,106.66 5.69,109.04 5.69,123.58 6.39,124.29 8.07,124.29 ; v1(86.65,124.35) 86.59,124.29 84.27,124.29 ; 84.27,86.19 84.27,87.87 81.89,90.25 81.89,104.54 82.59,105.24 84.27,105.24 ; 84.27,86.19 82.59,86.19 81.89,85.49 81.89,71.2 84.27,68.82 84.27,67.13 ; 8.07,124.29 8.07,125.97 10.45,128.35 27.12,128.35 ; 8.07,124.29 10.39,124.29 v1(10.45,124.35) ; 84.27,124.29 82.59,124.29 81.89,123.59 81.89,109.3 84.27,106.92 84.27,105.24 ; 84.27,124.29 84.27,128.35 ; 46.17,67.13 44.49,67.13 43.79,66.43 43.79,56.91 36.64,49.77 36.64,48.08 38.96,48.08 v1(39.02,48.15) ; 46.17,67.13 48.49,67.13 v1(48.55,67.2) ; 46.17,67.13 46.17,68.82 43.79,71.2 43.79,85.49 44.49,86.19 46.17,86.19 ; 108.08,124.29 110.34,124.29 v1(110.4,124.35) ; 108.08,124.29 108.08,128.32 108.11,128.35 ; v1(48.55,86.25) 48.49,86.19 46.17,86.19 ; 65.22,105.24 65.22,106.92 62.84,109.3 62.84,123.59 63.54,124.29 65.22,124.29 ; 65.22,105.24 63.54,105.24 62.84,104.54 62.84,90.25 65.22,87.87 65.22,86.19 ; 65.22,105.24 67.54,105.24 v1(67.6,105.3) ; 84.27,128.35 65.22,128.35 ; 84.27,128.35 108.11,128.35 ; v1(29.5,105.3) 29.44,105.24 27.12,105.24 ; 27.12,86.19 29.44,86.19 v1(29.5,86.25) ; 27.12,86.19 25.44,86.19 24.74,85.49 24.74,71.2 27.12,68.82 27.12,67.13 29.44,67.13 v1(29.5,67.2) ; 27.12,86.19 27.12,87.87 24.74,90.25 24.74,104.54 25.44,105.24 27.12,105.24 ; 46.17,128.35 27.12,128.35 ; 46.17,128.35 65.22,128.35 ; 46.17,128.35 46.17,124.29 ; 27.12,128.35 27.12,124.29 ; v1(10.45,86.25) 10.39,86.19 8.07,86.19 ; 8.07,86.19 6.39,86.19 5.69,85.48 5.69,61.67 8.07,59.29 8.07,57.61 10.39,57.61 v1(10.45,57.67) ; 46.17,105.24 44.49,105.24 43.79,104.54 43.79,90.25 46.17,87.87 46.17,86.19 ; 46.17,105.24 46.17,106.92 43.79,109.3 43.79,123.59 44.49,124.29 46.17,124.29 ; 46.17,105.24 48.49,105.24 v1(48.55,105.3) ; v1(67.6,124.35) 67.54,124.29 65.22,124.29 ; 27.12,105.24 27.12,106.92 24.74,109.3 24.74,123.59 25.44,124.29 27.12,124.29 ; 65.22,128.35 65.22,124.29 ; 27.12,124.29 29.44,124.29 v1(29.5,124.35) ; 84.27,67.13 86.59,67.13 v1(86.65,67.2) ; 84.27,67.13 82.59,67.13 81.89,66.43 81.89,52.15 84.27,49.77 84.27,48.08 86.59,48.08 v1(86.65,48.15) ; 108.11,128.35 130.16,128.35 134.1,124.41 C1.2 C2.2 C3.2 134.1,102.86 135.84,102.86 137.66,101.04 137.66,55.57 134.03,51.95 129.23,51.95 ; 84.27,105.24 86.59,105.24 v1(86.65,105.3) ; 46.17,124.29 48.49,124.29 v1(48.55,124.35)
  Bottom Layer w0.508: v1(67.6,86.25) 68.04,86.69 69.44,86.69 ; v1(39.02,48.15) 39.47,48.59 SW42.5 ; SW03.5 68.04,124.79 v1(67.6,124.35) ; v1(29.5,124.35) 29.94,124.79 SW01.5 ; 88.49,48.59 87.09,48.59 v1(86.65,48.15) ; v1(10.45,124.35) 10.89,124.79 SW00.5 ; v1(105.7,105.3) 106.14,105.74 SW15.5 ; v1(67.6,48.15) 68.04,48.59 SW43.5 ; v1(10.45,105.3) 10.89,105.74 SW10.5 ; SW34.5 87.09,67.64 v1(86.65,67.2) ; SW11.5 29.94,105.74 v1(29.5,105.3) ; SW02.5 48.99,124.79 v1(48.55,124.35) ; 12.29,86.69 10.89,86.69 v1(10.45,86.25) ; SW05.5 110.84,124.79 v1(110.4,124.35) ; v1(67.6,67.2) 68.04,67.64 SW33.5 ; v1(86.65,124.35) 87.09,124.79 SW04.5 ; v1(48.55,105.3) 48.99,105.74 SW12.5 ; 31.34,86.69 29.94,86.69 v1(29.5,86.25) ; v1(48.55,67.2) 48.99,67.64 SW32.5 ; v1(10.45,57.67) 10.89,58.12 SW30.5 ; SW14.5 87.09,105.74 v1(86.65,105.3) ; v1(67.6,105.3) 68.04,105.74 SW13.5 ; 88.49,86.69 87.09,86.69 v1(86.65,86.25) ; SW31.5 29.94,67.64 v1(29.5,67.2) ; v1(48.55,86.25) 48.99,86.69 50.39,86.69
BLUE: length 41.6
  Top Layer w0.254: R4.2 164.53,63.91 155.44,54.81 155.44,32.97 157.21,31.19 157.21,30.26 158.19,29.28
COL0: length 188.3
  Top Layer w0.254: R5.2 115.25,45.87 101.51,32.13 31.45,32.13 22.1,41.48 22.1,51.89 v1(22.36,52.15) v1(22.36,75.96) v1(22.36,95.01) v1(22.36,114.06)
  Bottom Layer w0.254: SW20.4 22.83,76.44 v1(22.36,75.96) ; SW00.4 22.83,114.54 v1(22.36,114.06) ; v1(22.36,52.15) 22.83,51.67 SW30.4 ; SW10.4 22.83,95.49 v1(22.36,95.01)
COL1: length 176.4
  Top Layer w0.254: v1(41.41,114.06) v1(41.41,95.01) v1(41.41,75.96) v1(41.41,56.91) ; R6.1 102.84,42.85 95.42,35.43 31.4,35.43
  Bottom Layer w0.254: SW21.4 41.88,76.44 v1(41.41,75.96) ; SW11.4 41.88,95.49 v1(41.41,95.01) ; v1(31.4,35.43) 30.21,36.62 30.21,49.99 37.14,56.91 v1(41.41,56.91) 41.88,57.39 SW31.4 ; v1(41.41,114.06) 41.88,114.54 SW01.4
COL2: length 155.9
  Top Layer w0.254: v1(60.46,114.06) v1(60.46,95.01) v1(60.46,75.96) v1(60.46,56.91) 60.46,51.64 v1(51.44,42.62) ; v1(52.46,34.44) 96.71,34.44 105.94,43.67 R7.1
  Bottom Layer w0.254: v1(52.46,34.44) 51.41,35.49 SW42.4 51.41,42.59 v1(51.44,42.62) ; SW12.4 60.93,95.49 v1(60.46,95.01) ; SW02.4 60.93,114.54 v1(60.46,114.06) ; SW22.4 60.93,76.44 v1(60.46,75.96) ; v1(60.46,56.91) 60.93,57.39 SW32.4
COL3: length 127.9
  Top Layer w0.254: v1(79.51,45) v1(79.51,56.91) v1(79.51,75.96) v1(79.51,95.01) v1(79.51,114.06) ; R8.1 109.05,44.49 97.99,33.44 v1(80.91,33.44)
  Bottom Layer w0.254: v1(79.51,95.01) 79.98,95.49 SW13.4 ; v1(79.51,56.91) 79.98,57.39 SW33.4 ; v1(79.51,75.96) 79.98,76.44 SW23.4 ; v1(80.91,33.44) 79.98,34.36 SW43.4 79.98,44.53 v1(79.51,45) ; v1(79.51,114.06) 79.98,114.54 SW03.4
COL4: length 108.4
  Top Layer w0.254: v1(98.56,114.06) v1(98.56,95.01) v1(98.56,75.96) v1(98.56,56.91) v1(98.56,49.77) ; v1(102.19,35.23) 102.32,35.23 112.15,45.05 R9.1
  Bottom Layer w0.254: v1(98.56,56.91) 99.03,57.39 SW34.4 ; v1(98.56,95.01) 99.03,95.49 SW14.4 ; SW24.4 99.03,76.44 v1(98.56,75.96) ; v1(98.56,49.77) 99.03,49.29 99.03,37.3 101.11,35.23 v1(102.19,35.23) ; SW04.4 99.03,114.54 v1(98.56,114.06)
COL5: length 44.1
  Top Layer w0.254: v1(122.37,114.06) 122.37,99.77 v1(117.61,95.01) 113.37,90.77 R10.1
  Bottom Layer w0.254: v1(122.37,114.06) 122.91,114.6 SW05.4 ; v1(117.61,95.01) 118.08,95.49 SW15.4
GREEN: length 38.2
  Top Layer w0.254: R3.2 168.14,65.96 168.14,63.7 157.47,53.03 157.47,37.79 159.75,35.51 159.75,34.49 160.56,33.68 160.73,33.68
INT#: length 35.1
  Top Layer w0.254: v2(121.82,70.86) U1.19
  Bottom Layer w0.254: U46.14 121.91,44.46 121.91,51.51 127.5,57.1 127.5,68.27 124.91,70.86 v2(121.82,70.86)
LED: length 68
  Top Layer w0.254: U46.15 125.42,33.52 v2(125.46,33.48)
  Bottom Layer w0.254: 94.33,48.59 95.62,48.59 97.95,50.92 108.29,50.92 111.24,47.97 111.24,30.43 114.29,27.38 121.91,27.38 125.46,30.94 v2(125.46,33.48)
PA8: length 63.5
  Top Layer w0.254: H5.1 150.1,31.02 154,27.13 156.87,27.13 U45.15
PA9: length 62.3
  Top Layer w0.254: U45.14 147.56,32.04 H5.2
PB4: length 62.6
  Bottom Layer w0.254: 122.88,40.95 132.93,40.95 139.69,47.7 139.69,74.88 H3.3
PB5: length 46.1
  Top Layer w0.254: H3.4 125.97,61.67 120.64,56.34 120.64,42.26 120.68,42.22
PB8: length 56.4
  Top Layer w0.254: SW45.4 161.53,32.71 161,31.92 159.49,31.47 U45.19
  Bottom Layer w0.254: U45.19 159.42,31.44 156.96,31.44 156.45,31.95 152.63,31.95
PB14: length 48
  Top Layer w0.254: H5.3 145.02,58.88 135.89,49.75 U46.19
PB15: length 48
  Top Layer w0.254: 125.76,51.02 125.77,51 128.26,51 128.77,50.49 134.86,50.49 142.48,58.11 H5.4
PB22: length 76.1
  Bottom Layer w0.254: 119.07,34.35 133.45,34.35 152.13,53.03 152.13,80.21 155.69,83.77 H2.1
RED: length 36.1
  Top Layer w0.254: R2.2 171.44,63.45 159.5,51.51 159.5,39.32 161.02,37.79 161.02,36.86 U45.23
ROW0: length 238.2
  Top Layer w0.254: U1.10 v2(108.22,60.7)
  Bottom Layer w0.254: 82.81,130.91 82.8,130.9 D04.1 ; 82.81,130.91 106.67,130.91 ; 82.81,130.91 63.75,130.91 ; 25.65,130.91 44.66,130.91 ; 25.65,130.91 25.65,130.91 D01.1 ; 25.65,130.91 10.63,130.91 6.59,126.87 6.59,124.32 ; 44.66,130.91 44.7,130.86 D02.1 ; 44.66,130.91 63.75,130.91 ; D03.1 63.75,130.91 63.75,130.91 ; D05.1 106.67,130.91 ; 106.67,130.91 124.57,130.91 128.4,127.08 128.4,98.39 104.38,74.37 104.38,62.43 106.11,60.7 v2(108.22,60.7)
ROW1: length 220.2
  Top Layer w0.254: U1.11 v2(121.94,60.7)
  Bottom Layer w0.254: 101.86,109.3 82.82,109.3 ; 101.86,109.3 101.84,109.28 D15.1 ; 101.86,109.3 122.37,109.3 ; 82.82,109.3 63.79,109.3 ; 82.82,109.3 82.8,109.28 D14.1 ; D12.1 44.7,109.26 44.73,109.3 ; 25.68,109.3 8.2,109.3 6.6,107.7 D10.1 ; 25.68,109.3 44.73,109.3 ; 25.68,109.3 25.65,109.27 D11.1 ; 63.79,109.3 44.73,109.3 ; 63.79,109.3 63.75,109.26 D13.1 ; v2(121.94,60.7) 122.42,60.22 122.42,58.88 121.06,57.53 107,57.53 103.37,61.16 103.37,74.88 127.4,98.91 127.4,104.44 122.4,109.43
ROW2: length 169.7
  Top Layer w0.254: U1.13 v2(121.94,63.24)
  Bottom Layer w0.254: 82.81,90.25 63.74,90.25 ; 82.81,90.25 82.8,90.24 D24.1 ; 82.81,90.25 98.92,90.25 102.38,86.78 102.38,60.11 105.99,56.51 121.06,56.51 122.95,58.4 122.95,62.22 v2(121.94,63.24) ; 63.74,90.25 44.7,90.25 ; 63.74,90.25 63.75,90.23 D23.1 ; D20.1 6.6,88.6 8.24,90.25 25.64,90.25 ; 44.7,90.25 25.64,90.25 ; 44.7,90.25 44.7,90.24 D22.1 ; D21.1 25.65,90.24 25.64,90.25
ROW3: length 164.8
  Top Layer w0.254: U1.14 v2(121.94,64.51)
  Bottom Layer w0.254: D34.1 82.8,71.19 82.8,71.2 ; 44.7,71.2 25.67,71.2 ; 44.7,71.2 63.76,71.2 ; 44.7,71.2 D32.1 ; 25.67,71.2 8.07,71.2 6.59,69.72 D30.1 ; 25.67,71.2 25.65,71.18 D31.1 ; 82.8,71.2 98.92,71.2 101.59,68.53 101.59,59.38 105.48,55.49 121.32,55.49 123.97,58.14 123.97,62.61 122.06,64.51 v2(121.94,64.51) ; 82.8,71.2 63.76,71.2 ; 63.76,71.2 63.75,71.19 D33.1
ROW4: length 112.2
  Top Layer w0.254: U1.15 v2(121.94,65.78)
  Bottom Layer w0.254: 63.74,52.15 D43.1 ; 63.74,52.15 82.9,52.15 ; 63.74,52.15 37.2,52.15 35.55,50.49 D42.1 ; v2(121.94,65.78) 122.06,65.78 124.98,62.86 124.98,57.89 119.24,52.15 82.9,52.15 ; 82.9,52.15 82.79,52.04 D44.1
RST: length 2.3
  Top Layer w0.254: 110.53,61.97 v2(108.22,61.97)
SCL1: length 111
  Top Layer w0.254: U1.3 v2(112.54,69.59)
  Bottom Layer w0.254: U46.7 120.36,36.52 132.07,36.52 143.24,47.7 143.24,79.96 133.85,89.36 121.4,89.36 118.1,86.05 118.1,75.15 v2(112.54,69.59)
SDA1: length 46.9
  Top Layer w0.254: U1.4 v2(112.54,68.32)
  Bottom Layer w0.254: 118.14,37.82 118.1,37.86 118.1,49.22 126.23,57.35 126.23,63.7 121.61,68.32 v2(112.54,68.32)
$1N69: length 9.9
  Bottom Layer w0.254: D00.2 6.6,114.24 7.1,113.74 SW00.3
$1N70: length 9.9
  Bottom Layer w0.254: D01.2 25.65,114.24 26.15,113.74 SW01.3
$1N71: length 9.9
  Bottom Layer w0.254: SW02.3 45.2,113.74 44.7,114.24 D02.2
$1N72: length 9.9
  Bottom Layer w0.254: D03.2 63.75,114.24 64.25,113.74 SW03.3
$1N73: length 9.9
  Bottom Layer w0.254: D04.2 82.8,114.24 83.3,113.74 SW04.3
$1N74: length 9.9
  Bottom Layer w0.254: D05.2 106.67,114.25 107.18,113.74 SW05.3
$1N77: length 9.9
  Bottom Layer w0.254: D10.2 6.6,96.48 6.59,96.47 6.59,95.2 7.1,94.69 SW10.3
$1N78: length 9.8
  Bottom Layer w0.254: D11.2 25.65,95.44 26.4,94.69 SW11.3
$1N79: length 9.9
  Bottom Layer w0.254: D12.2 44.7,95.19 45.2,94.69 SW12.3
$1N80: length 9.9
  Bottom Layer w0.254: D13.2 63.75,95.19 64.25,94.69 SW13.3
$1N81: length 9.9
  Bottom Layer w0.254: SW14.3 83.3,94.69 82.8,95.19 D14.2
$1N82: length 9.9
  Bottom Layer w0.254: SW15.3 102.35,94.69 101.84,95.2 D15.2
$1N83: length 9.9
  Bottom Layer w0.254: D20.2 6.6,76.14 7.1,75.64 SW20.3
$1N84: length 9.9
  Bottom Layer w0.254: SW21.3 26.15,75.64 25.65,76.14 D21.2
$1N85: length 9.9
  Bottom Layer w0.254: D22.2 44.7,76.14 45.2,75.64 SW22.3
$1N86: length 9.9
  Bottom Layer w0.254: SW23.3 64.25,75.64 63.75,76.14 D23.2
$1N87: length 9.9
  Bottom Layer w0.254: SW24.3 83.3,75.64 82.8,76.14 D24.2
$1N90: length 9
  Bottom Layer w0.254: SW30.3 6.59,49.34 D30.2
$1N91: length 9.9
  Bottom Layer w0.254: D31.2 25.65,57.09 26.15,56.59 SW31.3
$1N92: length 9.9
  Bottom Layer w0.254: D32.2 44.7,57.09 45.2,56.59 SW32.3
$1N95: length 9.9
  Bottom Layer w0.254: D33.2 63.75,57.09 64.25,56.59 SW33.3
$1N97: length 9.9
  Bottom Layer w0.254: SW34.3 83.3,56.59 82.8,57.09 D34.2
$1N99: length 8.7
  Bottom Layer w0.254: SW42.3 35.55,39.43 D42.2
$1N100: length 9.9
  Bottom Layer w0.254: D43.2 63.74,38.05 64.25,37.54 SW43.3
$1N101: length 9.9
  Bottom Layer w0.254: D44.2 82.79,38.05 83.3,37.54 SW44.3
$1N102: length 23.5
  Bottom Layer w0.254: 69.44,46.81 51.5,46.81 49.72,48.59 46.71,48.59
$1N103: length 13.9
  Bottom Layer w0.254: 88.49,46.81 80.08,46.81 78.3,48.59 SW43.2
$1N108: length 154.8
  Bottom Layer w0.254: 40.87,46.81 39.09,46.81 38.64,46.37 38.64,45.39 39.02,45 53.31,45 55.69,42.62 55.69,35.48 50.93,30.71 39.02,30.71 34.26,35.48 34.26,51.49 37.29,54.53 98.56,54.53 100.94,56.91 100.94,64.86 98.16,67.64 94.33,67.64
$1N109: length 13.9
  Bottom Layer w0.254: SW34.6 80.08,65.86 78.3,67.64 SW33.2
$1N110: length 13.9
  Bottom Layer w0.254: SW33.6 61.03,65.86 59.25,67.64 56.23,67.64
$1N111: length 13.9
  Bottom Layer w0.254: SW32.6 41.98,65.86 40.2,67.64 37.18,67.64
$1N112: length 18.9
  Bottom Layer w0.254: SW31.6 24.23,65.86 22.36,63.99 22.36,59.67 20.8,58.12 SW30.2
$1N113: length 193.8
  Bottom Layer w0.254: SW30.6 10.38,56.34 9.94,55.89 9.94,55.04 10.45,54.53 22.36,54.53 27.12,49.76 27.12,45 22.36,40.24 10.45,40.24 3.31,47.38 3.31,69.96 5.75,72.4 99.76,72.4 100.94,73.58 100.94,80.09 94.33,86.69
$1N114: length 13.9
  Bottom Layer w0.254: 88.49,84.91 80.08,84.91 78.3,86.69 75.28,86.69
$1N115: length 13.9
  Bottom Layer w0.254: 56.23,86.69 59.25,86.69 61.03,84.91 69.44,84.91
$1N116: length 13.9
  Bottom Layer w0.254: 37.18,86.69 40.2,86.69 41.98,84.91 50.39,84.91
$1N117: length 13.9
  Bottom Layer w0.254: 31.34,84.91 22.93,84.91 21.15,86.69 18.13,86.69
$1N118: length 196.9
  Bottom Layer w0.254: 12.29,84.91 10.38,84.91 9.94,84.47 9.94,83.61 10.45,83.1 22.36,83.1 24.74,80.72 24.74,75.96 22.36,73.58 5.69,73.58 4.35,74.91 4.35,89.93 5.88,91.45 118.81,91.45 119.99,92.63 119.99,104.54 118.78,105.74 113.38,105.74
$1N119: length 13.9
  Bottom Layer w0.254: 94.33,105.74 97.35,105.74 99.13,103.96 SW15.6
$1N120: length 13.9
  Bottom Layer w0.254: 75.28,105.74 78.3,105.74 80.08,103.96 SW14.6
$1N121: length 13.9
  Bottom Layer w0.254: 56.23,105.74 59.25,105.74 61.03,103.96 SW13.6
$1N122: length 13.9
  Bottom Layer w0.254: SW12.6 41.98,103.96 40.2,105.74 37.18,105.74
$1N123: length 13.9
  Bottom Layer w0.254: SW11.6 22.93,103.96 21.15,105.74 18.13,105.74
$1N125: length 18.8
  Bottom Layer w0.254: SW04.2 97.35,124.79 99.13,123.01 SW05.6
$1N126: length 13.9
  Bottom Layer w0.254: SW03.2 78.3,124.79 80.08,123.01 SW04.6
$1N127: length 13.9
  Bottom Layer w0.254: SW03.6 61.03,123.01 59.25,124.79 SW02.2
$1N128: length 13.9
  Bottom Layer w0.254: SW01.2 40.2,124.79 41.98,123.01 SW02.6
$1N129: length 13.9
  Bottom Layer w0.254: SW01.6 22.93,123.01 21.15,124.79 SW00.2
$1N130: length 203.1
  Bottom Layer w0.254: SW05.2 123.54,124.79 127.13,121.2 127.13,114.06 124.75,111.68 7.33,111.68 4.35,108.71 4.35,93.96 5.69,92.63 22.36,92.63 24.74,95.01 24.74,99.77 22.36,102.15 10.54,102.15 10.07,102.63 10.07,103.52 10.51,103.96 SW10.6
$1N63158: length 7.8
  Top Layer w0.254: R2.1 171.44,70.94 LED3.1
$1N63164: length 9.6
  Top Layer w0.254: 172.65,75.71 168.09,71.15 R3.1
$1N63171: length 11.3
  Top Layer w0.254: R4.1 164.53,69.37 LED3.4
$1N70752: length 27.7
  Top Layer w0.254: U1.20 122.12,72.13 123.43,70.81 123.43,60.65 115.25,52.48 R5.1
$1N70795: length 25.9
  Top Layer w0.254: U1.1 108.17,72.13 102.86,66.82 102.86,50.84 R6.2
$1N70838: length 24.8
  Top Layer w0.254: R7.2 105.94,55.79 103.9,57.83 103.9,66.16 108.6,70.86 U1.2
$1N70881: length 21.4
  Top Layer w0.254: U1.6 106.46,65.78 104.92,64.24 104.92,58.59 109.05,54.47 R8.2
$1N70924: length 20.1
  Top Layer w0.254: R9.2 112.15,53.39 105.91,59.64 105.91,63.19 107.22,64.51 U1.7
$1N70967: length 15.5
  Top Layer w0.254: U1.8 112.3,63.24 113.37,64.3 R10.2

## Copper pours and planes (outline as drawn; the poured copper is in the pictures)
GND on Top Layer: -30.49,161.49 236.21,161.49 236.21,-31.55 -30.49,-31.55
GND on Bottom Layer: -17.54,143.2 207.51,143.2 207.51,-6.66 -17.54,-6.66

Small or netless copper shapes (teardrops, artwork), in the pictures only: 5 on Top Layer, 21 on Bottom Layer

## Text on the board
Top Silkscreen Layer: MPU9250 | PB19 | PB21 | PB23 | PB1 | PB3 | PB5 | PB7 | PB18 | PB11 | PB20 | PB13 | PB22 | PB15 | PB0 | GND | PB2 | PB4 | PB6 | PB10 | PB12 | PB14 | VCC | 3V3 | 5V | PA5 | PA0 | PA2 | PA15 | PA14 | PA11 | NFC_CTR | PA9 | PA4 | PA7 | PA6 | LED0 | PA1 | PA3 | LED1 | PA13 | PA12 | PA10 | PA8 | PB9 | PB8 | PB17 | PB16 | H1 | H3 | RXD | WCH | Debug | TXD | RX | UART1 | TX | H2 | Download | SDK | SCL | NCS
